# Altium schematic sheet Other.SchDoc
size 431 x 279 mm; SheetNumber: 1; SheetTotal: 3
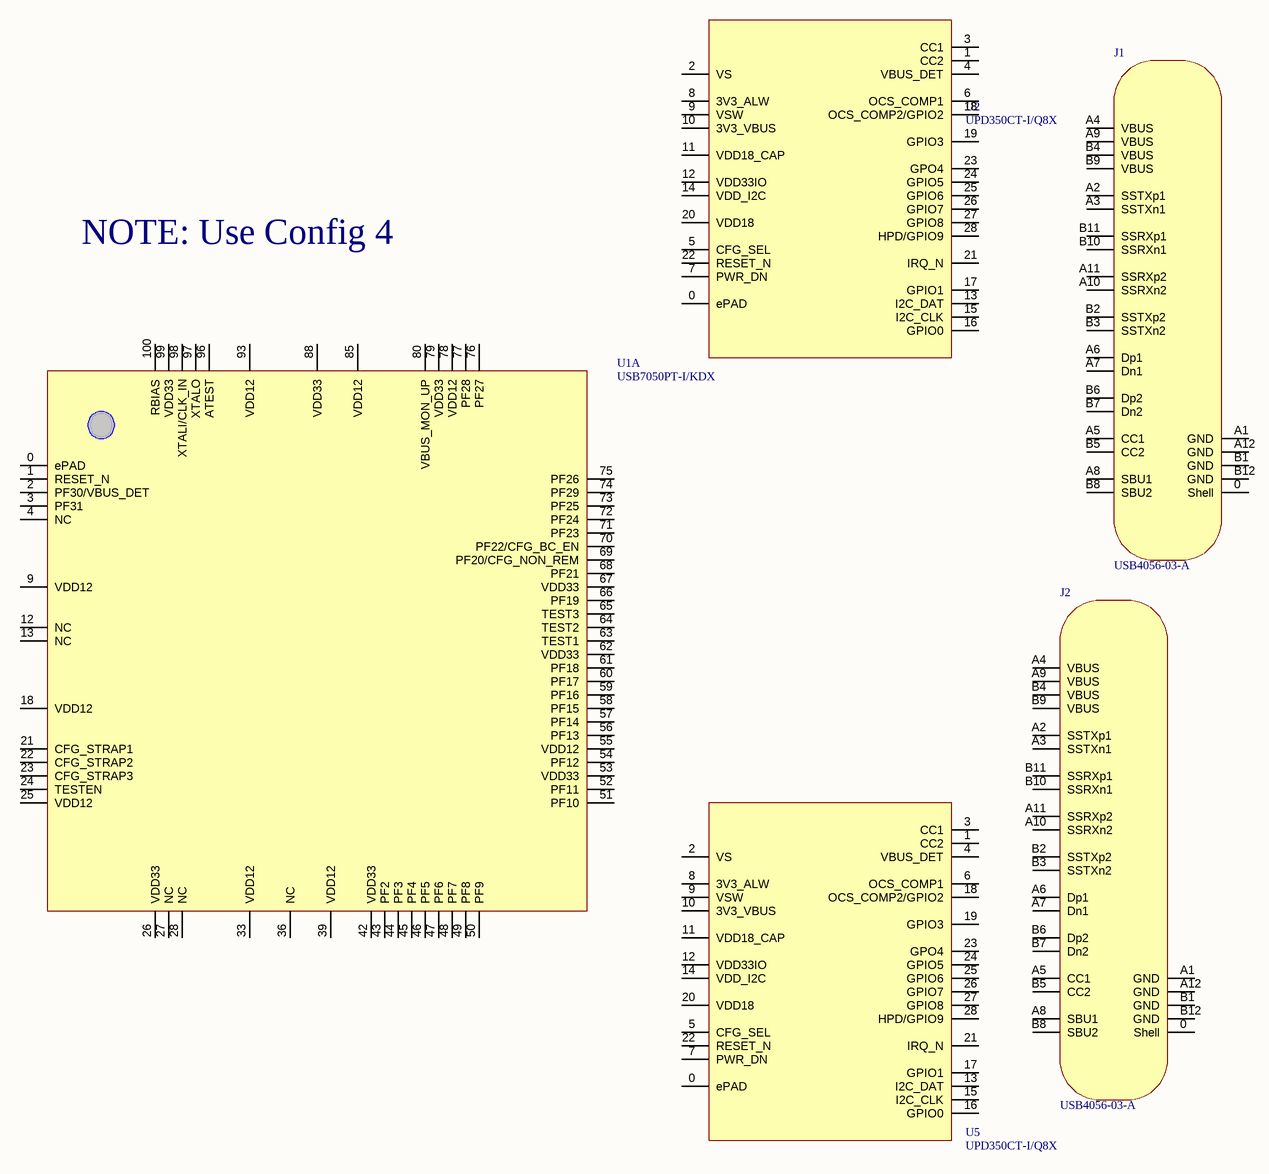
[diagram p0: Other.SchDoc]

## Parts
J1  USB4056-03-A  [USB4056-03-A]
J2  USB4056-03-A  [USB4056-03-A]
U1  USB7050PT-I/KDX  [100-VQFN (12x12)]  (part A of 6)
U2  UPD350CT-I/Q8X  [28-QFN (4x4)]
U5  UPD350CT-I/Q8X  [28-QFN (4x4)]

## Nets

Not connected (* = marked no-connect by the designer): J1 0(Shell) A1(GND) A2(SSTXp1) A3(SSTXn1) A4(VBUS) A5(CC1) A6(Dp1) A7(Dn1) A8(SBU1) A9(VBUS) A10(SSRXn2) A11(SSRXp2) A12(GND) B1(GND) B2(SSTXp2) B3(SSTXn2) B4(VBUS) B5(CC2) B6(Dp2) B7(Dn2) B8(SBU2) B9(VBUS) B10(SSRXn1) B11(SSRXp1) B12(GND); J2 0(Shell) A1(GND) A2(SSTXp1) A3(SSTXn1) A4(VBUS) A5(CC1) A6(Dp1) A7(Dn1) A8(SBU1) A9(VBUS) A10(SSRXn2) A11(SSRXp2) A12(GND) B1(GND) B2(SSTXp2) B3(SSTXn2) B4(VBUS) B5(CC2) B6(Dp2) B7(Dn2) B8(SBU2) B9(VBUS) B10(SSRXn1) B11(SSRXp1) B12(GND); U1 0(ePAD) 1(RESET_N) 2(PF30/VBUS_DET) 3(PF31) 4(NC) 9(VDD12) 12(NC) 13(NC) 18(VDD12) 21(CFG_STRAP1) 22(CFG_STRAP2) 23(CFG_STRAP3) 24(TESTEN) 25(VDD12) 26(VDD33) 27(NC) 28(NC) 33(VDD12) 36(NC) 39(VDD12) 42(VDD33) 43(PF2) 44(PF3) 45(PF4) 46(PF5) 47(PF6) 48(PF7) 49(PF8) 50(PF9) 51(PF10) 52(PF11) 53(VDD33) 54(PF12) 55(VDD12) 56(PF13) 57(PF14) 58(PF15) 59(PF16) 60(PF17) 61(PF18) 62(VDD33) 63(TEST1) 64(TEST2) 65(TEST3) 66(PF19) 67(VDD33) 68(PF21) 69(PF20/CFG_NON_REM) 70(PF22/CFG_BC_EN) 71(PF23) 72(PF24) 73(PF25) 74(PF29) 75(PF26) 76(PF27) 77(PF28) 78(VDD12) 79(VDD33) 80(VBUS_MON_UP) 85(VDD12) 88(VDD33) 93(VDD12) 96(ATEST) 97(XTALO) 98(XTALI/CLK_IN) 99(VDD33) 100(RBIAS); U2 0(ePAD) 1(CC2) 2(VS) 3(CC1) 4(VBUS_DET) 5(CFG_SEL) 6(OCS_COMP1) 7(PWR_DN) 8(3V3_ALW) 9(VSW) 10(3V3_VBUS) 11(VDD18_CAP) 12(VDD33IO) 13(I2C_DAT) 14(VDD_I2C) 15(I2C_CLK) 16(GPIO0) 17(GPIO1) 18(OCS_COMP2/GPIO2) 19(GPIO3) 20(VDD18) 21(IRQ_N) 22(RESET_N) 23(GPO4) 24(GPIO5) 25(GPIO6) 26(GPIO7) 27(GPIO8) 28(HPD/GPIO9); U5 0(ePAD) 1(CC2) 2(VS) 3(CC1) 4(VBUS_DET) 5(CFG_SEL) 6(OCS_COMP1) 7(PWR_DN) 8(3V3_ALW) 9(VSW) 10(3V3_VBUS) 11(VDD18_CAP) 12(VDD33IO) 13(I2C_DAT) 14(VDD_I2C) 15(I2C_CLK) 16(GPIO0) 17(GPIO1) 18(OCS_COMP2/GPIO2) 19(GPIO3) 20(VDD18) 21(IRQ_N) 22(RESET_N) 23(GPO4) 24(GPIO5) 25(GPIO6) 26(GPIO7) 27(GPIO8) 28(HPD/GPIO9)

## Notes on the sheet
- NOTE: Use Config 4
- DWG. NO.
- REV.
- SHT.
- THIS DOCUMENT AND THE DATA DISCLOSED HEREIN OR HEREWITH IS THE PROPERTY OF ALTIUM LIMITED AND MAY BE FREELY DISTRIBUTED IN WHOLE. NO RIGHTS ARE RESERVED OR EXPRESS OR IMPLIED WARANTEE GIVEN.
- REVISION
- DESCRIPTION
- DATE
- APPROVED
- ENG:
- APPROVALS
- PROJECT
- DSN:
- CHK:
- REFERENCE DOCUMENTS
- PROJECT REVISION:
- TITLE
- DOCUMENT REVISION:
- DESIGN ITEM:
- BOM:
- FAB DWG:
- PCB DWG:
- ASSY DWG:
- SCALE:
- SIZE
- B
- CAGE CODE
- FILE NAME
- DWG NO.
- SHEET
- OF
- REV

## Library data of the parts
J1 J2 = USB4056-03-A: USB-C (USB TYPE-C) USB 3.2 Gen 2 (USB 3.1 Gen 2, Superspeed + (USB 3.1)) Receptacle Connector 24 Position Surface Mount, Right Angle; Through Hole; Manufacturer: GCT; Voltage: 48VDC; Manufacturer Product Number: USB4056-03-A; Supplier: DigiKey; Supplier Part Number: 2073-USB4056-03-ACT-ND; Datasheet: https://gct.co/connector/usb4056; Standards: USB 3.2 Gen 2; Operating Temperature: -25°C ~ 85°C
U1 = USB7050PT-I/KDX: USB Hub Controller USB 2.0, USB 3.2 GPIO, I2C, I2S, SPI, UART, USB Interface 100-VQFN (12x12); Manufacturer: Microchip Technology; Voltage: 1.08V ~ 1.32V, 3V ~ 3.6V; Manufacturer Product Number: USB7050PT-I/KDX; Supplier: DigiKey; Supplier Part Number: 150-USB7050PT-I/KDXCT-ND; Datasheet: https://ww1.microchip.com/downloads/en/DeviceDoc/USB7050-Data-Sheet-DS00002672E.pdf; Standards: USB 2.0, USB 3.2; Operating Temperature: -40°C ~ 85°C
U2 U5 = UPD350CT-I/Q8X: USB Controller USB 3.0 I2C Interface 28-QFN (4x4); Manufacturer: Microchip Technology; Standards: USB 3.0; Voltage: 1.8V ~ 3.3V; Manufacturer Product Number: UPD350CT-I/Q8X; Supplier: DigiKey; Supplier Part Number: UPD350CT-I/Q8XCT-ND; Datasheet: https://ww1.microchip.com/downloads/en/DeviceDoc/UPD350-Data-Sheet-DS00002643C.pdf; Operating Temperature: -